# EasyEDA schematic Sheet_1.json
TITLE: Sheet_1; REV: 1.0; Date: 2023-06-30; Sheet: 1/1; Drawn By: pvk.pranav2003; Company: Your Company
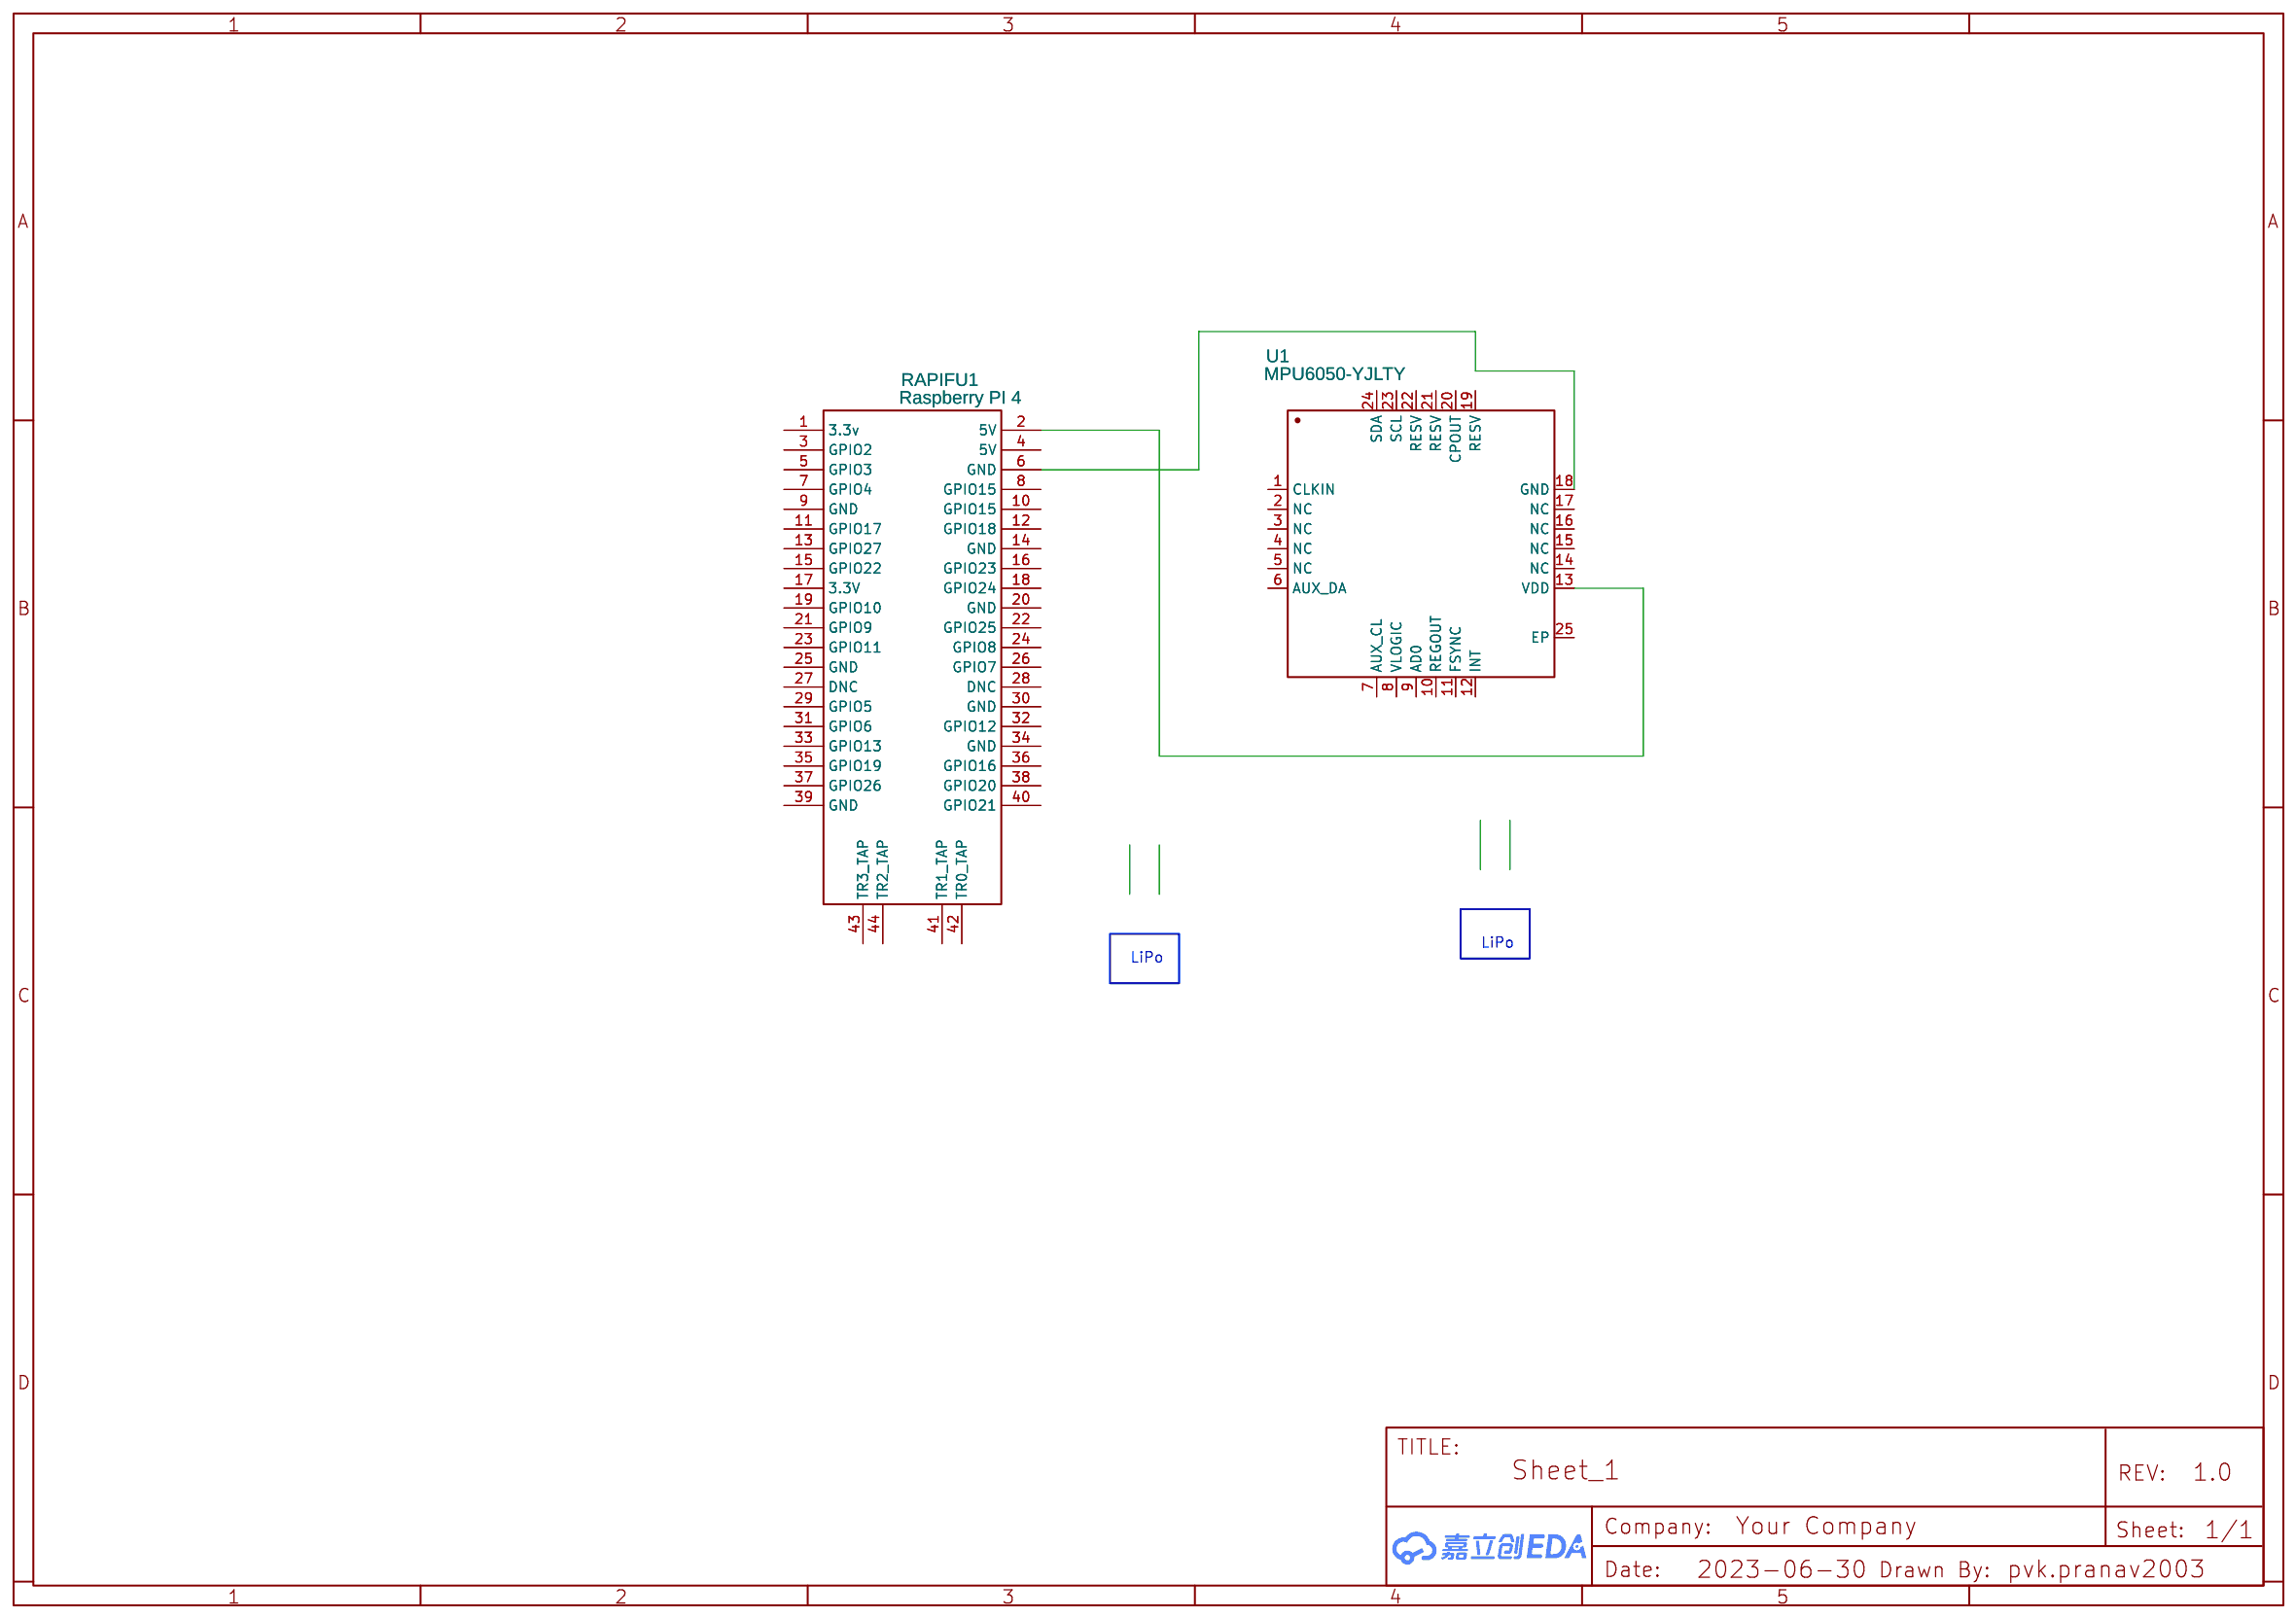
[diagram p0: schematic sheet]

## Parts
RAPIFU1  Raspberry PI 4
U1  MPU6050-YJLTY  [QFN-24_L4.0-W4.0-P0.50-BL-EP2.7]

## Library data of the parts
RAPIFU1 = -: Supplier: RS-Online; Contributor: EdddBrown
U1 = MPU6050-YJLTY: Supplier: LCSC; Supplier Part: C2912107; Manufacturer: null; JLCPCB Part Class: Extended Part; Contributor: LCSC

## Nets
Net-(RAPIFU1-2): RAPIFU1.2(5V) U1.13(VDD)
Net-(RAPIFU1-6): RAPIFU1.6(GND) U1.18(GND)

Not connected (* = marked no-connect by the designer): RAPIFU1 1(3.3v) 3(GPIO2) 4(5V) 5(GPIO3) 7(GPIO4) 8(GPIO15) 9(GND) 10(GPIO15) 11(GPIO17) 12(GPIO18) 13(GPIO27) 14(GND) 15(GPIO22) 16(GPIO23) 17(3.3V) 18(GPIO24) 19(GPIO10) 20(GND) 21(GPIO9) 22(GPIO25) 23(GPIO11) 24(GPIO8) 25(GND) 26(GPIO7) 27(DNC) 28(DNC) 29(GPIO5) 30(GND) 31(GPIO6) 32(GPIO12) 33(GPIO13) 34(GND) 35(GPIO19) 36(GPIO16) 37(GPIO26) 38(GPIO20) 39(GND) 40(GPIO21) 41(TR1_TAP) 42(TR0_TAP) 43(TR3_TAP) 44(TR2_TAP); U1 1(CLKIN) 2(NC) 3(NC) 4(NC) 5(NC) 6(AUX_DA) 7(AUX_CL) 8(VLOGIC) 9(AD0) 10(REGOUT) 11(FSYNC) 12(INT) 14(NC) 15(NC) 16(NC) 17(NC) 19(RESV) 20(CPOUT) 21(RESV) 22(RESV) 23(SCL) 24(SDA) 25(EP)

## Notes on the sheet
- LiPo
- LiPo
